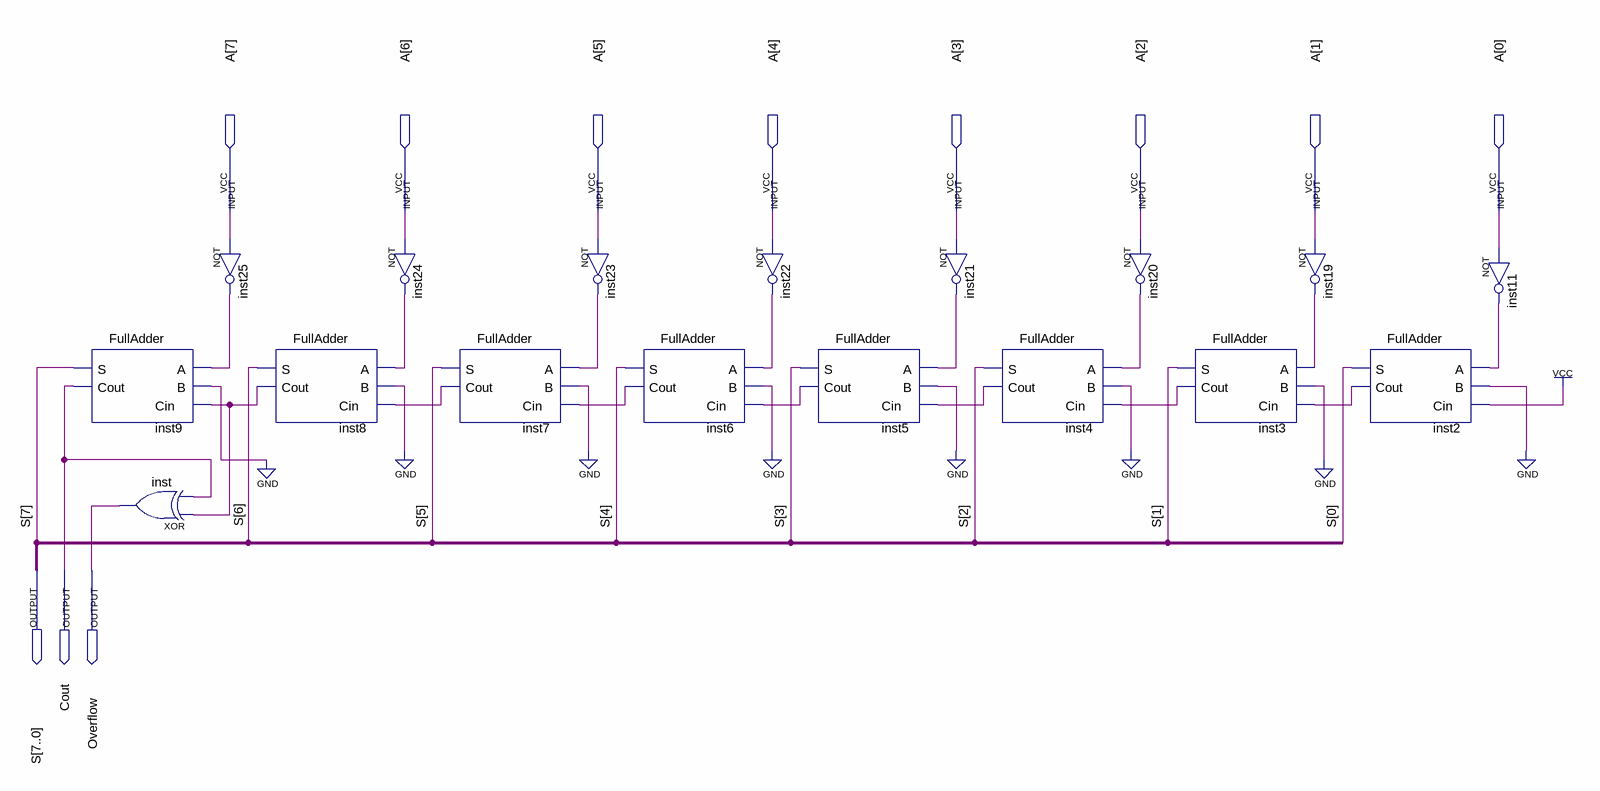
[diagram p0: schematic sheet]
// Quartus schematic TwosComplement8Bits.bdf as structural Verilog: 17 symbols, 11 pins
module TwosComplement8Bits (
  input  [7:0] A,
  output [7:0] S,
  output Cout,
  output Overflow
);

  wire inst2_cout, inst3_cout, inst4_cout, inst5_cout, inst6_cout, inst7_cout, inst8_cout, inst11_out,
       inst19_out, inst20_out, inst21_out, inst22_out, inst23_out, inst24_out, inst25_out;

  FullAdder inst9 (.A(inst25_out), .B(1'b0), .Cin(inst8_cout), .S(S[7]), .Cout(Cout));
  xor inst (Overflow, inst8_cout, Cout);
  not inst25 (inst25_out, A[7]);
  FullAdder inst8 (.A(inst24_out), .B(1'b0), .Cin(inst7_cout), .S(S[6]), .Cout(inst8_cout));
  not inst24 (inst24_out, A[6]);
  FullAdder inst7 (.A(inst23_out), .B(1'b0), .Cin(inst6_cout), .S(S[5]), .Cout(inst7_cout));
  not inst23 (inst23_out, A[5]);
  FullAdder inst6 (.A(inst22_out), .B(1'b0), .Cin(inst5_cout), .S(S[4]), .Cout(inst6_cout));
  not inst22 (inst22_out, A[4]);
  FullAdder inst5 (.A(inst21_out), .B(1'b0), .Cin(inst4_cout), .S(S[3]), .Cout(inst5_cout));
  not inst21 (inst21_out, A[3]);
  FullAdder inst4 (.A(inst20_out), .B(1'b0), .Cin(inst3_cout), .S(S[2]), .Cout(inst4_cout));
  not inst20 (inst20_out, A[2]);
  FullAdder inst3 (.A(inst19_out), .B(1'b0), .Cin(inst2_cout), .S(S[1]), .Cout(inst3_cout));
  not inst19 (inst19_out, A[1]);
  FullAdder inst2 (.A(inst11_out), .B(1'b0), .Cin(1'b1), .S(S[0]), .Cout(inst2_cout));
  not inst11 (inst11_out, A[0]);
endmodule
